# EAGLE design AtlasShield (EAGLE 6.5.0)
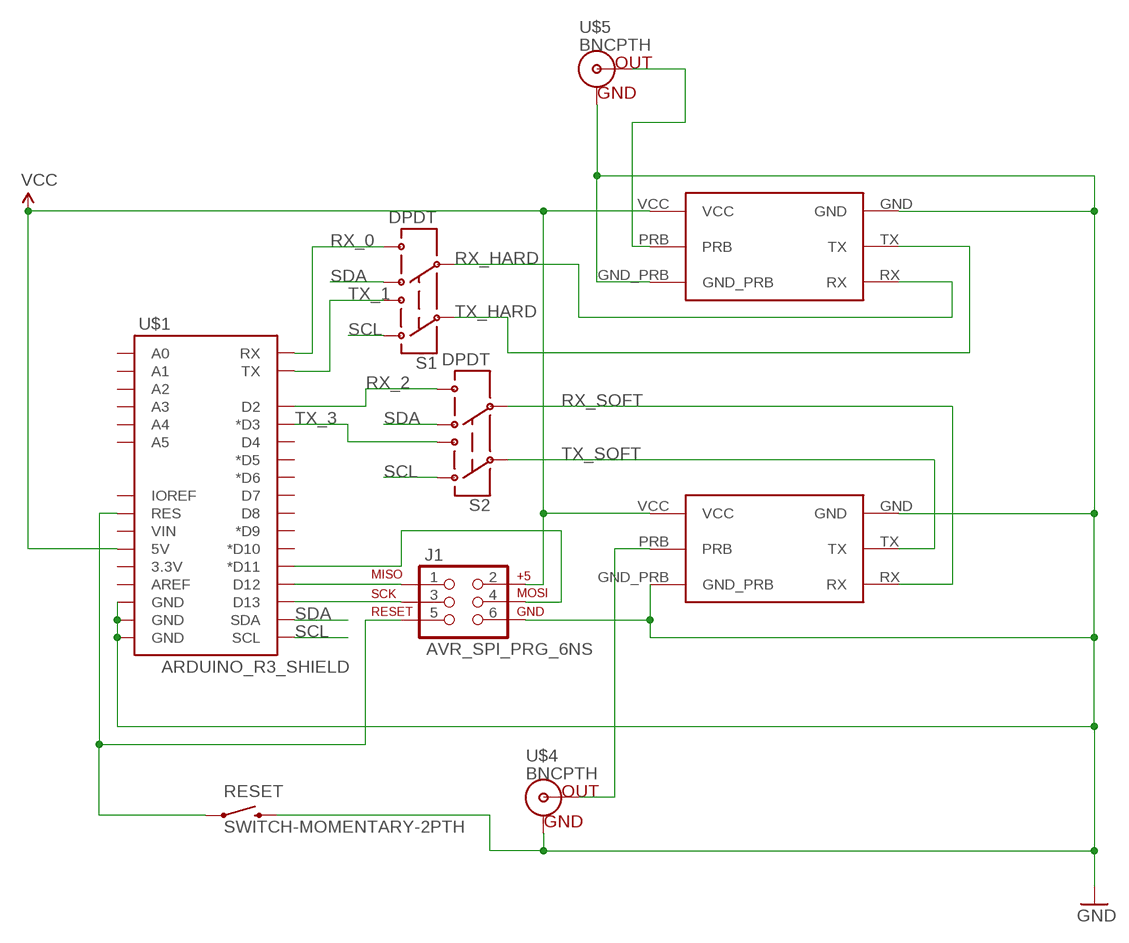
[diagram p0: schematic, sheet 1]

## Parts
J1  AVR_SPI_PRG_6NS  [2X3-NS]
RESET  SWITCH-MOMENTARY-2PTH  [TACTILE-PTH]
S1  DPDT  SWITCH-DPDTAYZ0202  [AYZ0202]
S2  DPDT  SWITCH-DPDTAYZ0202  [AYZ0202]
U$1  ARDUINO_R3_SHIELD  [UNO_R3_SHIELD]
U$2  ATLAS-CIRCUIT  [ATLAS-CIRCUIT]
U$3  ATLAS-CIRCUIT  [ATLAS-CIRCUIT]
U$4  BNCPTH  [BNC]
U$5  BNCPTH  [BNC]

## Nets
GND: J1.6 RESET.3 U$1.GND@0(GND) U$1.GND@1(GND) U$1.GND@2(GND) U$2.GND U$2.GND_PRB U$3.GND U$3.GND_PRB U$4.GND U$5.GND
N$5: J1.5 RESET.1 U$1.RES
N$6: J1.4 U$1.D11(*D11)
N$7: J1.1 U$1.D12
N$8: J1.3 U$1.D13
N$9: U$2.PRB U$5.S(OUT)
N$10: U$3.PRB U$4.S(OUT)
RX_0: S1.6 U$1.RX
RX_2: S2.6 U$1.D2
RX_HARD: S1.5 U$2.RX
RX_SOFT: S2.5 U$3.RX
SCL: S1.1 S2.1 U$1.SCL
SDA: S1.4 S2.4 U$1.SDA
TX_1: S1.3 U$1.TX
TX_3: S2.3 U$1.D3(*D3)
TX_HARD: S1.2 U$2.TX
TX_SOFT: S2.2 U$3.TX
VCC: J1.2 U$1.5V U$2.VCC U$3.VCC
Unconnected: U$1.3.3V U$1.A0 U$1.A1 U$1.A2 U$1.A3 U$1.A4 U$1.A5 U$1.AREF U$1.D4 U$1.D5(*D5) U$1.D6(*D6) U$1.D7 U$1.D8 U$1.D9(*D9) U$1.D10(*D10) U$1.IOREF U$1.VIN

## Library data of the parts
J1 = SparkFun-Connectors:AVR_SPI_PRG_6: AVR ISP 6 Pin This is the reduced ISP connector for AVR programming. Common on Arduino. This footprint will take up less PCB space and can be used with a 10-pin to 6-pin adapter such as SKU: BOB-08508
RESET = SparkFun-Electromechanical:SWITCH-MOMENTARY-2: Various NO switches- pushbuttons, reed, etc
S1 S2 = SparkFun-Electromechanical:SWITCH-DPDT: DPDT Version of the COM-00597; PROD_ID: SWCH-08179
U$1 = SparkFun-Boards:ARDUINO_R3_SHIELD: Shield form compatible with the Arduino Uno R3.
U$2 U$3 = awickert:ATLAS-CIRCUIT
U$4 U$5 = SparkFun-Connectors:BNC: BNC Connector, Mouser Part# 5227161

## Board
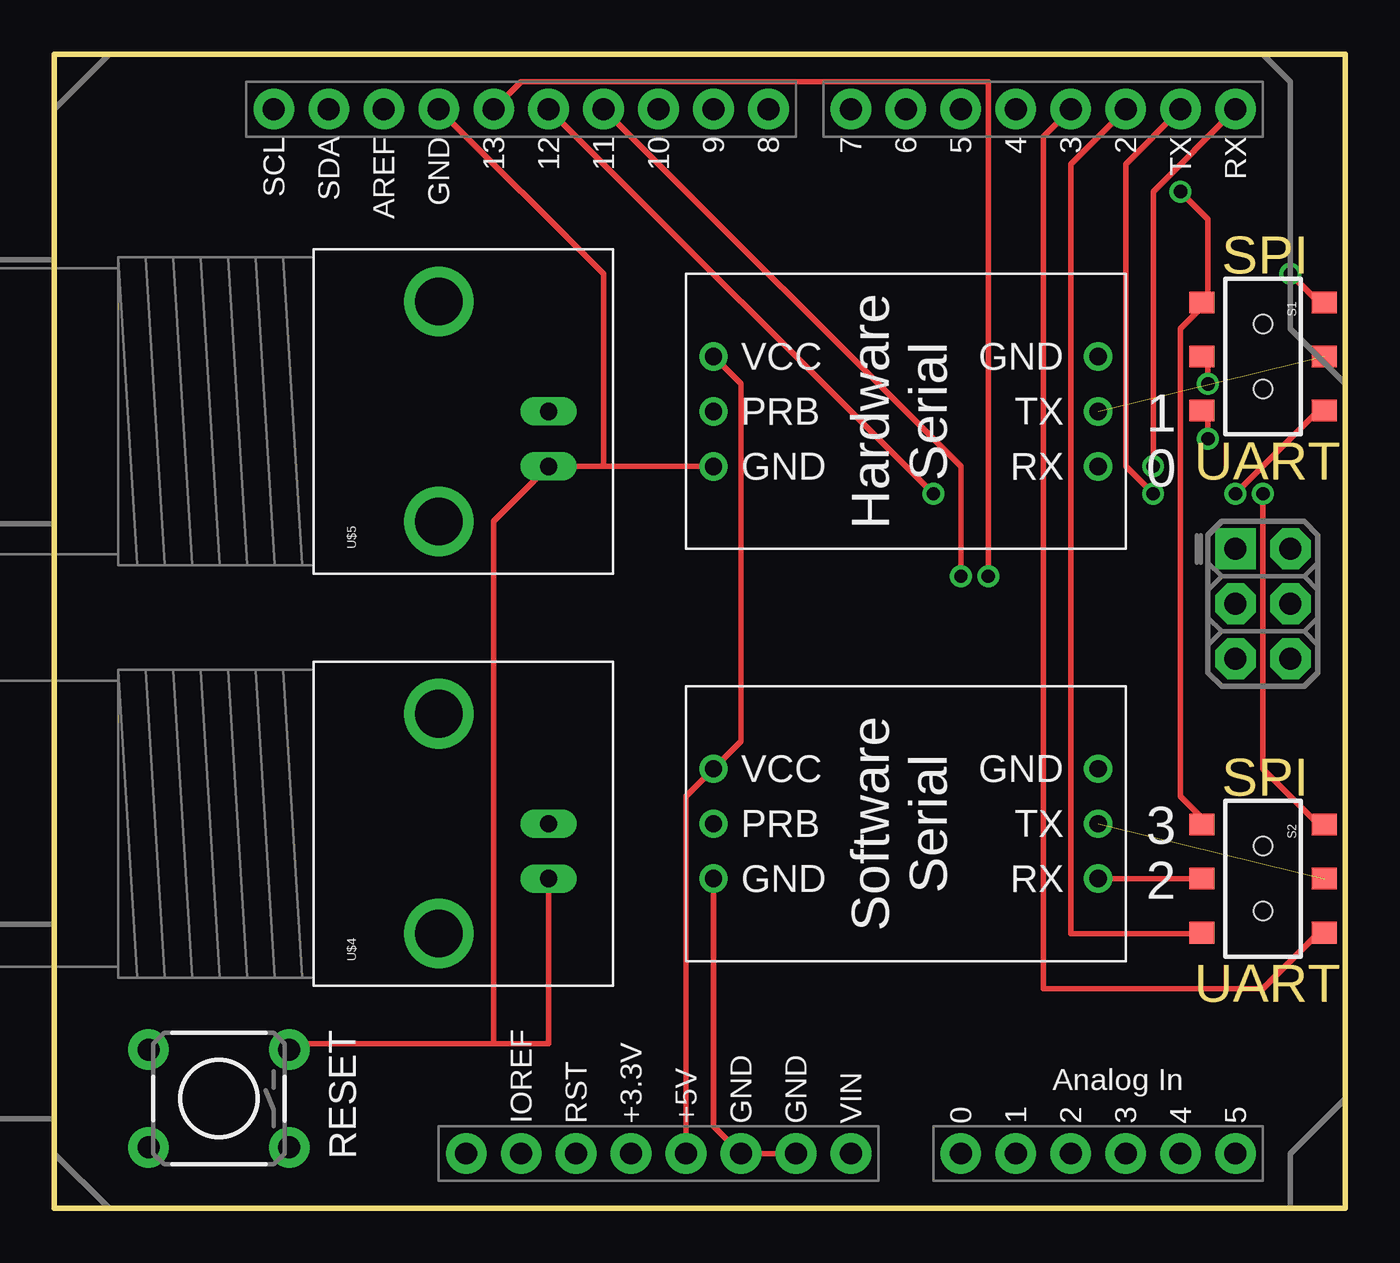
[diagram p1: board, top side]
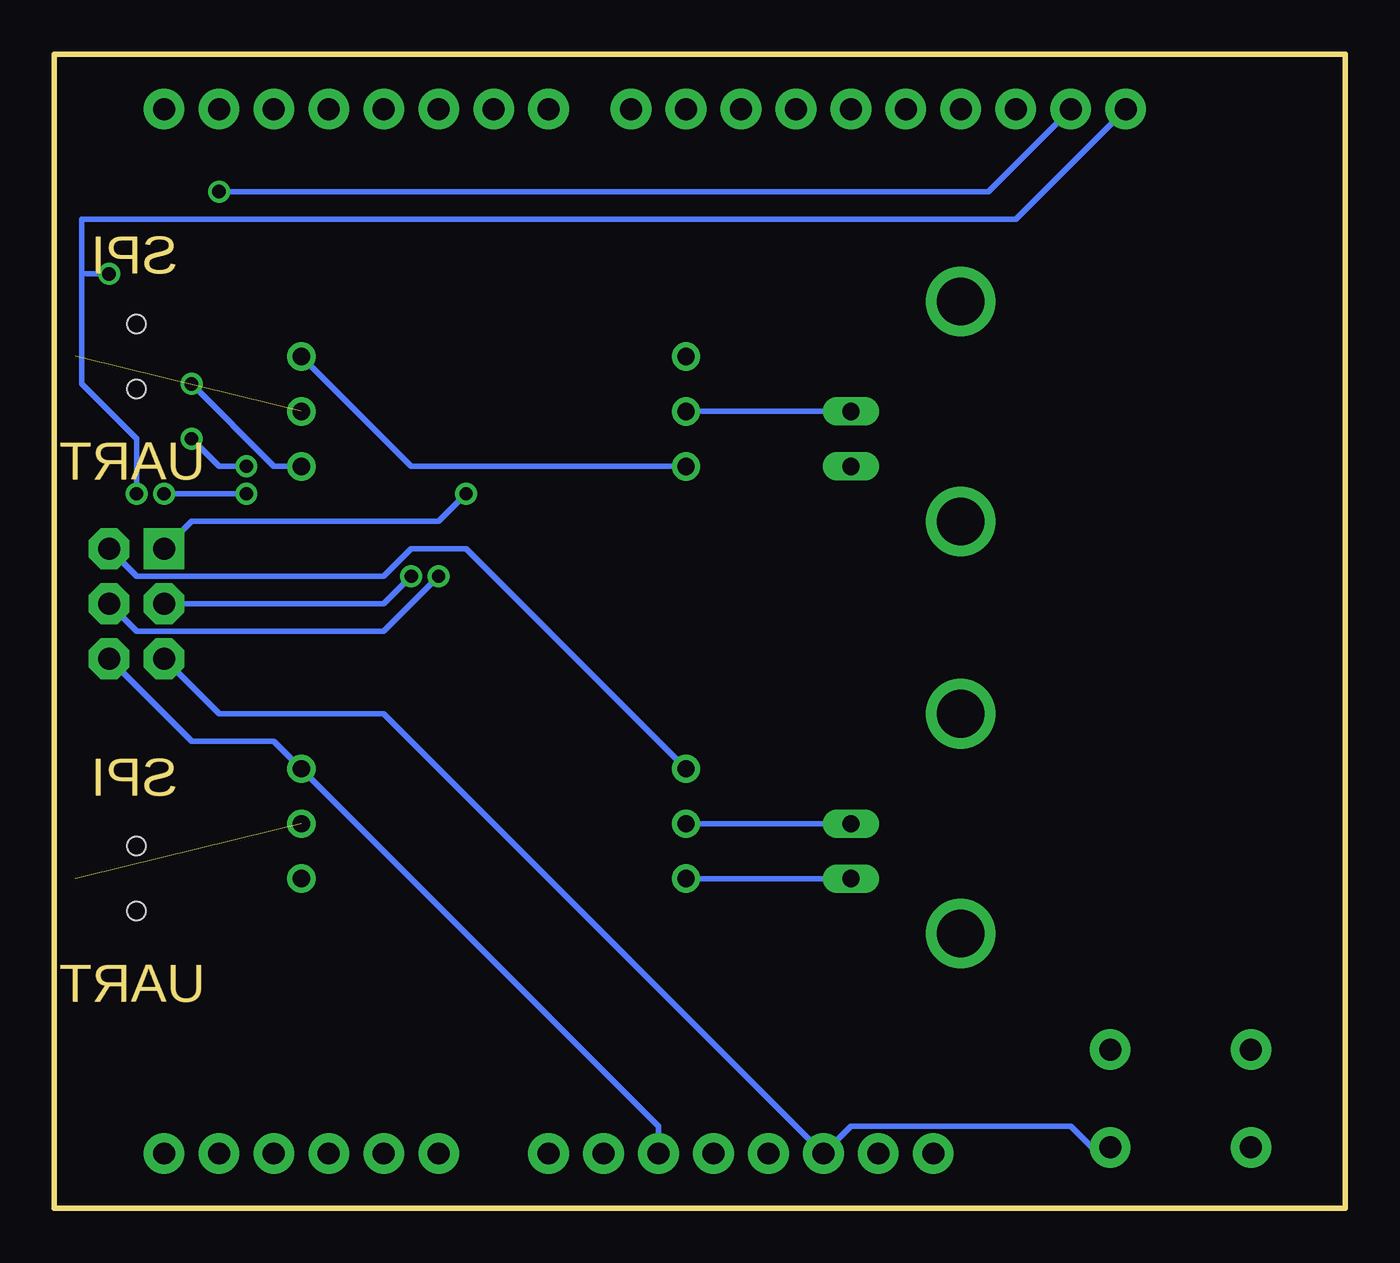
[diagram p2: board, bottom side, seen from below]

Size 59.69 x 53.34 mm. Coordinates in mm from the lower left corner, seen from the top.
Outline: 0,0 59.69,0 59.69,53.34 0,53.34 0,0
Copper layers (1*16): Top 0.035mm / dielectric 1.5mm / Bottom 0.035mm
Design rules "default": minimum track width 10mil, minimum drill 24mil, track to track 8mil, track to pad 8mil, pad to pad 8mil, via to via 8mil, smd to smd 8mil, copper to edge 40mil, drill to drill 8mil, minimum pad ring 10mil, minimum via ring 8mil, stop-mask expansion 4mil, vias tented up to drill 0mil, thermal gap 10mil

### Footprints (pad centres in the part's own frame; a part is rotated, then mirrored left to right if it is on the bottom)
2X3-NS = drill 1.016 pad 1.88 square: 1 -2.54,-1.27 | drill 1.016 pad 1.88 octagon: 2 -2.54,1.27; 3 0,-1.27; 4 0,1.27; 5 2.54,-1.27; 6 2.54,1.27
TACTILE-PTH = drill 1.016 pad 1.88: 1 -3.251,2.261; 2 3.251,2.261; 3 -3.251,-2.261; 4 3.251,-2.261
AYZ0202 = smd 1 x 1.15: 1 -2.5,2.825; 2 0,2.825; 3 2.5,2.825; 4 -2.5,-2.825; 5 0,-2.825; 6 2.5,-2.825 | hole 0.85: 1.5,0; -1.5,0
UNO_R3_SHIELD = drill 1.016 pad 1.88: 3.3V 50.8,26.67; 5V 50.8,29.21; A0 50.8,41.91; A1 50.8,44.45; A2 50.8,46.99; A3 50.8,49.53; A4 50.8,52.07; A5 50.8,54.61; AREF 2.54,15.24; D2 2.54,49.53; D3 2.54,46.99; D4 2.54,44.45; D5 2.54,41.91; D6 2.54,39.37; D7 2.54,36.83; D8 2.54,33.02; D9 2.54,30.48; D10 2.54,27.94; D11 2.54,25.4; D12 2.54,22.86; D13 2.54,20.32; GND@0 50.8,31.75; GND@1 50.8,34.29; GND@2 2.54,17.78; IOREF 50.8,21.59; NC 50.8,19.05; RES 50.8,24.13; RX 2.54,54.61; SCL 2.54,10.16; SDA 2.54,12.7; TX 2.54,52.07; VIN 50.8,36.83
ATLAS-CIRCUIT = drill 0.8: GND 3.81,19.05; GND_PRB 8.89,1.27; PRB 6.35,1.27; RX 8.89,19.05; TX 6.35,19.05; VCC 3.81,1.27
BNC = drill 2.2: 3 -5.08,5.08; 4 5.08,5.08 | drill 0.8 long: GND -2.54,0; S 0,0

### Placement (x,y rotation side)
J1  55.88,27.94 270 top
RESET  7.62,5.08 180 top
S1  55.88,39.37 270 top
S2  55.88,15.24 270 top
U$1  0,53.34 270 top
U$2  29.21,43.18 270 top
U$3  29.21,24.13 270 top
U$4  22.86,17.78 90 top
U$5  22.86,36.83 90 top

### Tracks (layer width: path | path; a pad name or v marks a point on that pad's centre or on a via)
GND
  Top 0.254: U$2.GND_PRB 25.4,34.29 | 25.4,34.29 U$5.GND 20.32,31.75 20.32,7.62 | U$1.GND@2 25.4,43.18 25.4,34.29 | U$1.GND@1 U$1.GND@0 30.48,3.81 U$3.GND_PRB | 20.32,7.62 22.86,7.62 U$4.GND | 20.32,7.62 11.43,7.62 RESET.3
  Bottom 0.254: U$2.GND 43.18,34.29 U$2.GND_PRB | J1.6 53.34,21.59 49.53,21.59 U$3.GND 31.75,3.81 U$1.GND@0 | U$3.GND_PRB U$4.GND
N$5
  Bottom 0.254: RESET.1 11.43,2.54 12.7,3.81 22.86,3.81 U$1.RES 44.45,22.86 52.07,22.86 J1.5
N$6  (via drill 0.61)
  Top 0.254: U$1.D11 41.91,34.29 v41.91,29.21
  Bottom 0.254: v41.91,29.21 44.45,26.67 55.88,26.67 J1.4
N$7  (via drill 0.61)
  Top 0.254: v40.64,33.02 U$1.D12
  Bottom 0.254: v40.64,33.02 41.91,31.75 53.34,31.75 J1.1
N$8  (via drill 0.61)
  Top 0.254: U$1.D13 21.59,52.07 43.18,52.07 v43.18,29.21
  Bottom 0.254: v43.18,29.21 44.45,27.94 J1.3
N$9
  Bottom 0.254: U$2.PRB U$5.S
N$10
  Bottom 0.254: U$3.PRB U$4.S
RX_0  (via drill 0.61)
  Top 0.254: v53.34,35.56 53.34,36.83 S1.6 | v50.8,34.29 50.8,46.99 U$1.RX
  Bottom 0.254: v53.34,35.56 52.07,34.29 v50.8,34.29
RX_2
  Top 0.254: U$1.D2 46.99,48.26 46.99,12.7 53.34,12.7 S2.6
RX_HARD  (via drill 0.61)
  Top 0.254: v53.34,38.1 53.34,39.37 S1.5
  Bottom 0.254: v53.34,38.1 49.53,34.29 U$2.RX
RX_SOFT
  Top 0.254: U$3.RX S2.5 53.34,15.24
SCL  (via drill 0.61)
  Top 0.254: v55.88,33.02 55.88,20.32 58.42,17.78 S2.1 | v57.15,43.18 58.42,41.91 S1.1
  Bottom 0.254: v55.88,33.02 55.88,35.56 58.42,38.1 58.42,43.18 | 58.42,43.18 58.42,45.72 15.24,45.72 U$1.SCL | 58.42,43.18 v57.15,43.18
SDA  (via drill 0.61)
  Top 0.254: 53.34,41.91 52.07,40.64 52.07,19.05 53.34,17.78 S2.4 | v52.07,46.99 53.34,45.72 53.34,41.91 | 53.34,41.91 S1.4
  Bottom 0.254: U$1.SDA 16.51,46.99 v52.07,46.99
TX_1  (via drill 0.61)
  Top 0.254: v54.61,33.02 58.42,36.83 S1.3 | v50.8,33.02 49.53,34.29 49.53,48.26 U$1.TX
  Bottom 0.254: v50.8,33.02 v54.61,33.02
TX_3
  Top 0.254: U$1.D3 45.72,49.53 45.72,10.16 55.88,10.16 58.42,12.7 S2.3
TX_HARD  (1 unrouted)
TX_SOFT  (1 unrouted)
VCC
  Top 0.254: U$1.5V 29.21,19.05 U$3.VCC 31.75,21.59 31.75,38.1 U$2.VCC
  Bottom 0.254: J1.2 55.88,29.21 44.45,29.21 43.18,30.48 40.64,30.48 U$3.VCC

### Text on the board
Dimension: SPI | UART | SPI | UART
tPlace: Hardware / Serial | 1 | 0 | Software / Serial | 3 | 2